# Altium project MB1389.PrjPcb (part 2 of 3)

## Sheet STLink_V3E_PWR.SchDoc: ST-LINK/V3E-SWD Power Module
size A4; Date: Not used; ApprovedBy: Not used; CheckedBy: Not used; Author: Alphonse BRUNO; CompanyName: STMicroelectronics; DrawnBy: Not used; Engineer: Not used; Organization: Not used; Address1: Not used; Address2: Not used; Address3: Not used; Address4: Not used; DocumentNumber: Not used; Revision: Not used; SheetNumber: 8; SheetTotal: 8; CurrentTime: Not used; CurrentDate: Not used; Time: Not used; DocumentFullPathAndName: Not used; DocumentName: Not used; ModifiedDate: Not used; ImagePath: Not used; ProjectName: Not used; Application_BuildNumber: Not used
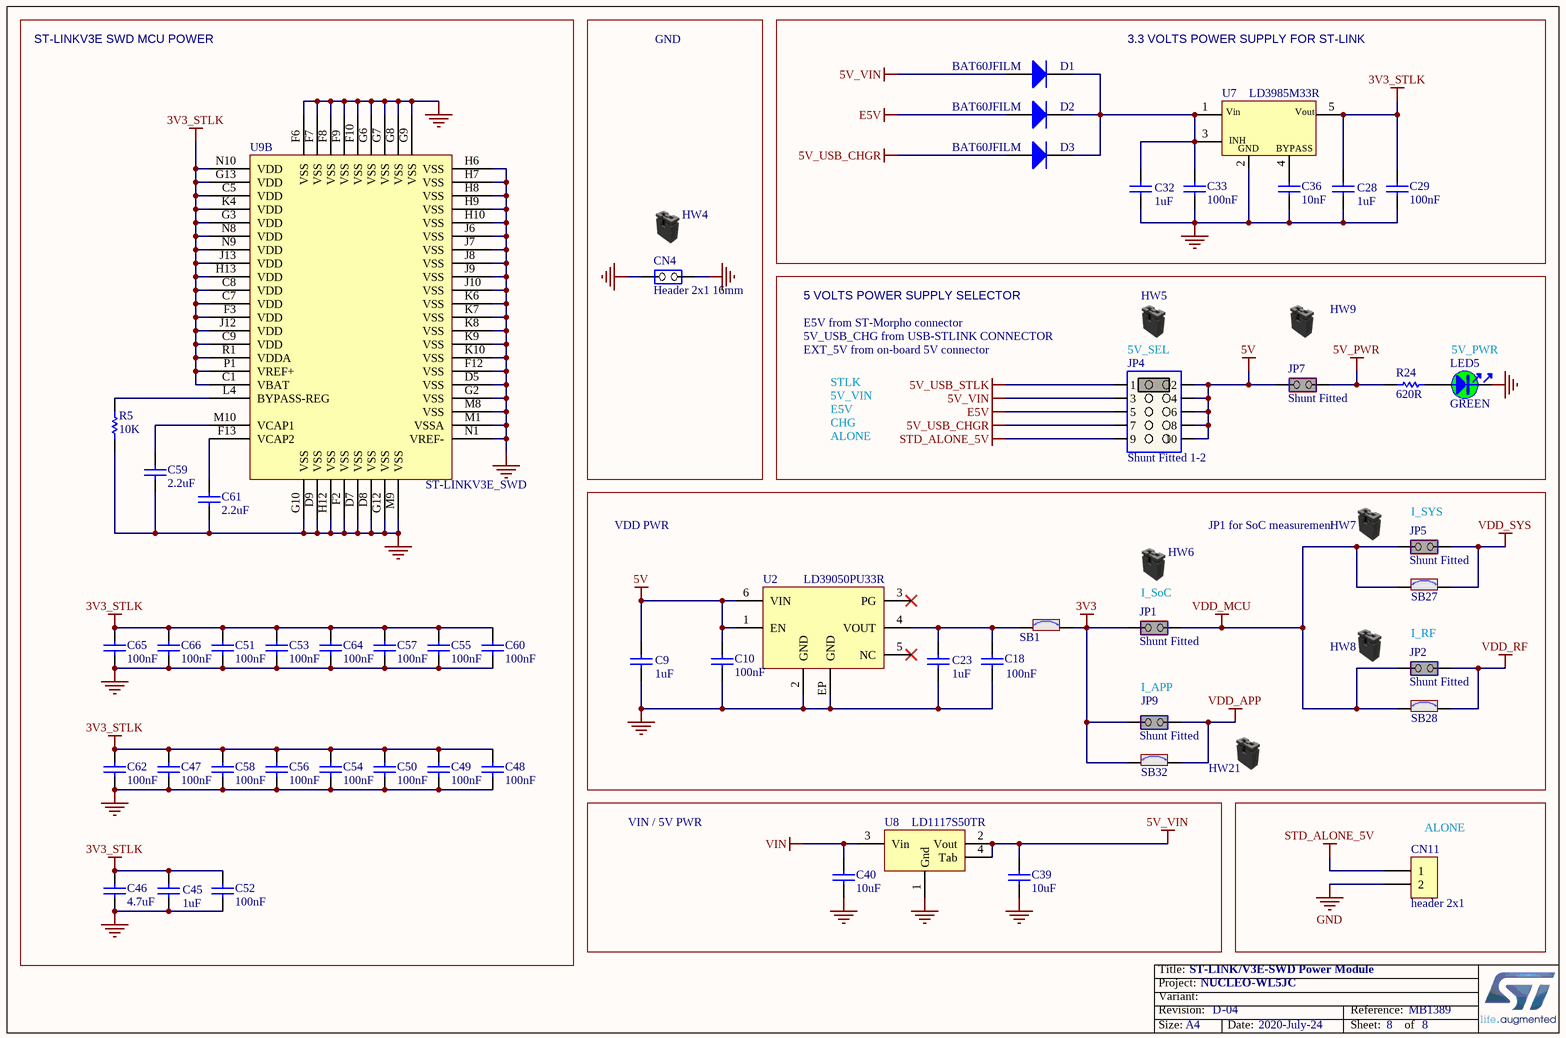
[diagram p4: STLink_V3E_PWR.SchDoc]

### Parts
C9  value 1uF  [C0603]
C10  value 100nF  [C0402]
C18  value 100nF  [C0402]
C23  value 1uF  [C0603]
C28  value 1uF  [C0603]
C29  value 100nF  [C0402]
C32  value 1uF  [C0603]
C33  value 100nF  [C0402]
C36  value 10nF  [C0402]
C39  value 10uF  [C0805]
C40  value 10uF  [C0805]
C45  value 1uF  [C0603]
C46  value 4.7uF  [C0603]
C47  value 100nF  [C0402]
C48  value 100nF  [C0402]
C49  value 100nF  [C0402]
C50  value 100nF  [C0402]
C51  value 100nF  [C0402]
C52  value 100nF  [C0402]
C53  value 100nF  [C0402]
C54  value 100nF  [C0402]
C55  value 100nF  [C0402]
C56  value 100nF  [C0402]
C57  value 100nF  [C0402]
C58  value 100nF  [C0402]
C59  value 2.2uF  [C0603]
C60  value 100nF  [C0402]
C61  value 2.2uF  [C0603]
C62  value 100nF  [C0402]
C64  value 100nF  [C0402]
C65  value 100nF  [C0402]
C66  value 100nF  [C0402]
CN4  value Header 2x1 16mm  [CON_SAMTEC_TSW-102-09-X-S]
CN11  value header 2x1  [CON_988-JIUBABA_PHFS25-11-02-G0B115-T-1]
D1  value BAT60JFILM  [DIO_SOD323]
D2  value BAT60JFILM  [DIO_SOD323]
D3  value BAT60JFILM  [DIO_SOD323]
HW4  (no value)  (mechanical)
HW5  (no value)  (mechanical)
HW6  (no value)  (mechanical)
HW7  (no value)  (mechanical)
HW8  (no value)  (mechanical)
HW9  (no value)  (mechanical)
HW21  (no value)  (mechanical)
JP1  value Shunt Fitted  [CON_SAMTEC_TSW-102-07-G-S]
JP2  value Shunt Fitted  [CON_SAMTEC_TSW-102-07-G-S]
JP4  value Shunt Fitted 1-2  [CON_SAMTEC_TSW-105-07-X-D]
JP5  value Shunt Fitted  [CON_SAMTEC_TSW-102-07-G-S]
JP7  value Shunt Fitted  [CON_SAMTEC_TSW-102-07-G-S]
JP9  value Shunt Fitted  [CON_SAMTEC_TSW-102-07-G-S]
LED5  value GREEN  [LED_0603_OSRAM_LG-Q396-PS-35_GREEN_1A2K_H0P4]
R5  value 10K  [R0402]
R24  value 620R  [R0402]
SB1  (no value)  [SOLDER-BRIDGE_R0603-0R]
SB27  (no value)  [SOLDER-BRIDGE_R0603-0R]
SB28  (no value)  [SOLDER-BRIDGE_R0603-0R]
SB32  (no value)  [SOLDER-BRIDGE_R0603-0R]
U2  value LD39050PU33R  [ICC_DFN6-EPAD_3X3_P095]
U7  value LD3985M33R  [REG_SOT23-5L]
U8  value LD1117S50TR  [REG_SOT223-TAB]
U9  value ST-LINKV3E_SWD  [ICC_UFBGA201_176+25_10X10_P065]  (part B of 2)

### Blocks framed on the sheet
ST-LINKV3E SWD MCU POWER: C45-C62 C64-C66 R5 U9
GND: CN4 HW4
3.3 VOLTS POWER SUPPLY FOR ST-LINK: C28 C29 C32 C33 C36 D1-D3 U7
VIN / 5V PWR: C39 C40 U8
ALONE: CN11

### Nets
3V3: JP1.1(COMMON) JP9.1(COMMON) SB1.2 SB32.1
3V3_STLK: C28.2 C29.2 C45.2 C46.2 C47.2 C48.2 C49.2 C50.2 C51.2 C52.2 C53.2 C54.2 C55.2 C56.2 C57.2 C58.2 C60.2 C62.2 C64.2 C65.2 C66.2 U7.5(Vout) U9.C1(VBAT) U9.C5(VDD) U9.C7(VDD) U9.C8(VDD) U9.C9(VDD) U9.F3(VDD) U9.G3(VDD) U9.G13(VDD) U9.H13(VDD) U9.J12(VDD) U9.J13(VDD) U9.K4(VDD) U9.N8(VDD) U9.N9(VDD) U9.N10(VDD) U9.P1(VREF+) U9.R1(VDDA)
5V: C9.2 C10.2 JP4.2 JP4.4 JP4.6 JP4.8 JP4.10 JP7.1(COMMON) U2.1(EN) U2.6(VIN)
5V_PWR: JP7.2(NO) R24.1
5V_USB_CHGR: D3.1(A) JP4.7
5V_USB_STLK: JP4.1
5V_VIN: C39.2 D1.1(A) JP4.3 U8.2(Vout) U8.4(Tab)
E5V: D2.1(A) JP4.5
GND: C9.1 C10.1 C18.1 C23.1 C28.1 C29.1 C32.1 C33.1 C36.1 C39.1 C40.1 C45.1 C46.1 C47.1 C48.1 C49.1 C50.1 C51.1 C52.1 C53.1 C54.1 C55.1 C56.1 C57.1 C58.1 C59.1 C60.1 C61.1 C62.1 C64.1 C65.1 C66.1 CN4.1(COMMON) CN4.2(NO) CN11.2 LED5.2 R5.1 U2.2(GND) U2.EP(GND) U7.2(GND) U8.1(Gnd) U9.D5(VSS) U9.D7(VSS) U9.D8(VSS) U9.D9(VSS) U9.F2(VSS) U9.F6(VSS) U9.F7(VSS) U9.F8(VSS) U9.F9(VSS) U9.F10(VSS) U9.F12(VSS) U9.G2(VSS) U9.G6(VSS) U9.G7(VSS) U9.G8(VSS) U9.G9(VSS) U9.G10(VSS) U9.G12(VSS) U9.H6(VSS) U9.H7(VSS) U9.H8(VSS) U9.H9(VSS) U9.H10(VSS) U9.H12(VSS) U9.J6(VSS) U9.J7(VSS) U9.J8(VSS) U9.J9(VSS) U9.J10(VSS) U9.K6(VSS) U9.K7(VSS) U9.K8(VSS) U9.K9(VSS) U9.K10(VSS) U9.M1(VSSA) U9.M8(VSS) U9.M9(VSS) U9.N1(VREF-)
STD_ALONE_5V: CN11.1 JP4.9
VDD_APP: JP9.2(NO) SB32.2
VDD_MCU: JP1.2(NO) JP2.1(COMMON) JP5.1(COMMON) SB27.1 SB28.1
VDD_RF: JP2.2(NO) SB28.2
VDD_SYS: JP5.2(NO) SB27.2
VIN: C40.2 U8.3(Vin)
NetC18_2: C18.2 C23.2 SB1.1 U2.4(VOUT)
NetC32_2: C32.2 C33.2 D1.2(K) D2.2(K) D3.2(K) U7.1(Vin) U7.3(CE)
NetC36_2: C36.2 U7.4(BYPASS)
NetC59_2: C59.2 U9.M10(VCAP1)
NetC61_2: C61.2 U9.F13(VCAP2)
NetLED5_1: LED5.1 R24.2
NetR5_2: R5.2 U9.L4(BYPASS-REG)

Not connected (* = marked no-connect by the designer): U2 3(PG)* 5(NC)*

### Notes on the sheet
- 5 VOLTS POWER SUPPLY SELECTOR
- E5V from ST-Morpho connector
- 5V_USB_CHG from USB-STLINK CONNECTOR
- EXT_5V from on-board 5V connector
- STLK
- 5V_SEL
- 5V_PWR
- E5V
- 5V_VIN
- CHG
- ALONE
- (near JP5) I_SYS
- VDD PWR
- (near HW6) JP1 for SoC measurement
- I_SoC
- I_RF
- (near JP9) I_APP
- Title:
- Project:
- Size:
- Revision:
- Variant:
- A4
- -
- Date:
- Reference:
- Sheet:
- of
- (in symbol MCD-00086) INH

### Library data of the parts
C9 C23 C28 C32 C45 = MCD-00010: Capacitor, MLCC, 1uF, 16V, X5R, 10%, 0603, T=0,8mm; Manufacturer_Part_Number: CC0603KRX5R7BB105; Manufacturer: YAGEO; Provided_By: SUBCO; ECCN_US: EAR99; ECCN_EU: NEC; Internal_Part_Number: MCD-00010; Status: Released; Package: C0603; ComponentLink1Description: Datasheet; Part_Type: Capacitor; ComponentLink1URL: http://tunmcdsvn.tun.st.com/Component_Datasheet_Library/Trunk/Capacitors/Yageo_Multilayer_capacitor_X5R_series_100pF_to_100uF
C10 C18 C29 C33 C47-C58 C60 C62 C64-C66 = MCD-00102: Capacitor, MLCC, 100nF, 16V, X7R, 10%, 0402, T=0,5mm; Manufacturer_Part_Number: CC0402KRX7R7BB104; Manufacturer: YAGEO; Alternate_Manufacturer_Part_Number: GCM155R71C104KA55D; Alternate_Manufacturer: MURATA; Provided_By: SUBCO; ECCN_US: EAR99; ECCN_EU: NEC; Internal_Part_Number: MCD-00102; Status: Released; Package: C0402; ComponentLink1Description: Datasheet; Part_Type: Capacitor; ComponentLink1URL: http://tunmcdsvn.tun.st.com/Component_Datasheet_Library/Trunk/Capacitors/Yageo_Multilayer_Capacitor_X7R_series_100pF_to_22uF
C36 = MCD-00011: Capacitor, MLCC, 10nF, 16V, X7R, 10%, 0402, T=0.5mm; Manufacturer_Part_Number: CC0402KRX7R7BB103; Manufacturer: YAGEO; Provided_By: SUBCO; ECCN_US: EAR99; ECCN_EU: NEC; Internal_Part_Number: MCD-00011; Status: Released; Part_Type: Capacitor; Package: C0402; ComponentLink1Description: Datasheet; ComponentLink1URL: http://tunmcdsvn.tun.st.com/Component_Datasheet_Library/Trunk/Capacitors/Yageo_Multilayer_Capacitor_X7R_series_100pF_to_22uF
C39 C40 = MCD-00014: Capacitor, MLCC, 10uF, 25V, X5R, 10%, 0805, T=0,85mm; Manufacturer_Part_Number: CC0805KRX5R8BB106; Manufacturer: YAGEO; Provided_By: SUBCO; ECCN_US: EAR99; ECCN_EU: NEC; Internal_Part_Number: MCD-00014; ComponentLink1Description: Datasheet; Status: Released; Part_Type: Capacitor; Package: C0805; ComponentLink1URL: http://tunmcdsvn.tun.st.com/Component_Datasheet_Library/Trunk/Capacitors/Yageo_Multilayer_capacitor_X5R_series_100pF_to_100uF
C46 = MCD-00009: Capacitor, MLCC, 4.7uF, 16V, X5R, 10%, 0603, T=0.8mm; Manufacturer_Part_Number: CC0603KRX5R7BB475; Manufacturer: YAGEO; Provided_By: SUBCO; ECCN_US: EAR99; ECCN_EU: NEC; Internal_Part_Number: MCD-00009; Status: Released; Part_Type: Capacitor; Package: C0603; ComponentLink1Description: Datasheet; ComponentLink1URL: http://tunmcdsvn.tun.st.com/Component_Datasheet_Library/Trunk/Capacitors/Yageo_Multilayer_capacitor_X5R_series_100pF_to_100uF
C59 C61 = MCD-00012: Capacitor, MLCC, 2.2uF, 10V, X5R, 10%, 0603, T=0,8mm; Manufacturer_Part_Number: CC0603KRX5R6BB225; Manufacturer: YAGEO; Alternate_Manufacturer_Part_Number: C0603C225K8PACTU; Alternate_Manufacturer: KEMET; BMS_Part_Number: 9142010; Provided_By: SUBCO; ECCN_US: EAR99; ECCN_EU: NEC; Internal_Part_Number: MCD-00012; Status: Released; Part_Type: Capacitor; Package: C0603; ComponentLink1Description: Datasheet; ComponentLink1URL: http://tunmcdsvn.tun.st.com/Component_Datasheet_Library/Trunk/Capacitors/Yageo_Multilayer_capacitor_X5R_series_100pF_to_100uF
CN4 = MCD-00214: Header, 2x1, 2,54mm, VR, TH, Height 5.84mm/10.16mm; Part_Type: Connector; Manufacturer_Part_Number: TSW-102-09-x-S; Manufacturer: SAMTEC; Provided_By: SUBCO; Internal_Part_Number: MCD-00214; Status: Released; ComponentLink1Description: Datasheet; ComponentLink1URL: http://tunmcdsvn.tun.st.com/Component_Datasheet_Library/Trunk/Connectors/Samtec_TSW-HTSW-series; ECCN_US: n/a; ECCN_EU: n/a
CN11 = MCD-00314: Header, 2x1, 2.54mm, VR, TH, Height 6mm/3mm; Part_Type: Connector; Manufacturer_Part_Number: PHFS25-11-02-G0B115-T-1; Manufacturer: JIUBABA; Provided_By: SUBCO; Internal_Part_Number: MCD-00314; Status: Released; ComponentLink1Description: Datasheet; ComponentLink1URL: http://tunmcdsvn.tun.st.com/Component_Datasheet_Library/Trunk/Connectors/Jiubaba_PHFS25_11XXXXXXXXXX; ECCN_US: n/a; ECCN_EU: n/a
D1-D3 = MCD-00034: BAT60JFILM; Manufacturer: STMICROELECTRONICS; Part_Type: Diode; BMS_Part_Number: 9151097; Provided_By: SUBCO with ST control; ECCN_US: EAR99; ECCN_EU: NEC; Internal_Part_Number: MCD-00034; Status: Released; Manufacturer_Part_Number: BAT60JFILM; ComponentLink1Description: Datasheet; ComponentLink1URL: http://tunmcdsvn.tun.st.com/Component_Datasheet_Library/Trunk/Diodes/STM_Diode_BAT60JFILM-SOD323
HW4-HW9 HW21 = MCD-00043: SHUNT 2.54mm BLACK; Manufacturer_Part_Number: SNT-100-BK-G; Manufacturer: SAMTEC; Part_Type: Mechanical; Alternate_Manufacturer_Part_Number: 316102S111A; Alternate_Manufacturer: JIUBABA; Provided_By: SUBCO; Value: SNT-100-BK-G; Internal_Part_Number: MCD-00043; ComponentLink1Description: Datasheet; Status: Released; ComponentLink1URL: http://tunmcdsvn.tun.st.com/Component_Datasheet_Library/Trunk/Connectors/Samtec_Shunt_Jumper_SNT100; ECCN_US: n/a; ECCN_EU: n/a
JP1 JP2 JP5 JP7 JP9 = MCD-00683: Header, 2x1, 2,54mm, VR, TH, Height 5.84mm/2.54mm - Shunt Fitted by default; Part_Type: Connector; Manufacturer_Part_Number: TSW-102-07-x-S; Manufacturer: SAMTEC; Alternate_Manufacturer_Part_Number: 313102S111116; Alternate_Manufacturer: LIANYI; Provided_By: SUBCO; Internal_Part_Number: MCD-00683; Status: Released; ComponentLink1Description: Datasheet; ComponentLink1URL: http://tunmcdsvn.tun.st.com/Component_Datasheet_Library/Trunk/Connectors/Samtec_TSW-HTSW-series; ECCN_US: n/a; ECCN_EU: n/a
JP4 = MCD-01203: Header, 5x2, 2,54mm, VR, TH, Height 5.84mm/2.54mm - Shunt Fitted 1-2; Part_Type: Connector; Manufacturer_Part_Number: TSW-105-07-x-D; Manufacturer: SAMTEC; BMS_Part_Number: 9083523; Provided_By: SUBCO; Internal_Part_Number: MCD-01203; Status: Released; ComponentLink1Description: Datasheet; ComponentLink1URL: http://tunmcdsvn.tun.st.com/Component_Datasheet_Library/Trunk/Connectors/Samtec_TSW-HTSW-series; ECCN_US: n/a; ECCN_EU: n/a
LED5 = MCD-00588: LED Green, 0603 SMD, Forward Voltage Typ=2V, Max=2.5V; Part_Type: Display; Manufacturer_Part_Number: LG Q396-PS-35; Manufacturer: OSRAM OPTO SEMICONDUCTORS; Alternate_Manufacturer_Part_Number: VLMTG1300-GS08; Alternate_Manufacturer: VISHAY SEMICONDUCTOR OPTO DIVISION; Provided_By: SUBCO; Internal_Part_Number: MCD-00588; Status: Released; Package: LED 0603; ComponentLink1Description: Datasheet; ComponentLink1URL: http://tunmcdsvn.tun.st.com/Component_Datasheet_Library/Trunk/Display/OSRAM_LED_GREEN_LG Q396-PS-35; Order_Code_Digikey: LG Q396-PS-35-ND; ECCN_US: n/a; ECCN_EU: n/a
R5 = MCD-00053: Resistor,10K,0402,1%,1/16W; Manufacturer_Part_Number: RC0402FR-0710KL; Manufacturer: YAGEO; BMS_Part_Number: 9131590; Provided_By: SUBCO; ECCN_US: EAR99; ECCN_EU: NEC; Internal_Part_Number: MCD-00053; Status: Released; ComponentLink1Description: Datasheet; Part_Type: Resistor; Package: R0402; ComponentLink1URL: http://tunmcdsvn.tun.st.com/Component_Datasheet_Library/Trunk/Resistors/Yageo_Resistor_RC0402-series
R24 = MCD-00499: Resistor,620R,0402,1%,1/16W; Manufacturer_Part_Number: RC0402FR-07620RL; Manufacturer: YAGEO; Provided_By: SUBCO; ECCN_US: EAR99; ECCN_EU: NEC; Internal_Part_Number: MCD-00499; Status: Released; Part_Type: Resistor; Package: R0402; ComponentLink1Description: Datasheet; ComponentLink1URL: http://tunmcdsvn.tun.st.com/Component_Datasheet_Library/Trunk/Resistors/Yageo_Resistor_RC0402-series
SB1 SB27 SB28 SB32 = MCD-00071: as SB2 on sheet STM32_microcontroller_IOs; Internal_Part_Number: MCD-00071; Status: Released; Package: SB0603; ComponentLink1Description: Datasheet; ComponentLink1URL: http://tunmcdsvn.tun.st.com/Component_Datasheet_Library/Trunk/Resistors/Yageo_Resistor_RC0603-series; ECCN_US: n/a; ECCN_EU: n/a
U2 = MCD-00215: Low quiescent current and low noise voltage regulators; Manufacturer: STMICROELECTRONICS; Part_Type: IC; BMS_Part_Number: 9176126; Provided_By: SUBCO with ST control; ECCN_US: EAR99; ECCN_EU: NEC; Internal_Part_Number: MCD-00215; Manufacturer_Part_Number: LD39050PU33R; Status: Released; ComponentLink1Description: Datasheet; ComponentLink1URL: http://tunmcdsvn.tun.st.com/Component_Datasheet_Library/Trunk/IC/STM_LDO_LD39050PU; Package: DFN6 3x3mm
U7 = MCD-00086: Ultra low drop-low noise BiCMOS voltage, regulators low ESR capacitors compatible; Manufacturer: STMICROELECTRONICS; Part_Type: IC; BMS_Part_Number: 9176161; Provided_By: SUBCO with ST control; ECCN_US: EAR99; ECCN_EU: NEC; Internal_Part_Number: MCD-00086; Status: Released; Manufacturer_Part_Number: LD3985M33R; ComponentLink1Description: Datasheet; ComponentLink1URL: http://tunmcdsvn.tun.st.com/Component_Datasheet_Library/Trunk/IC/STM_LDO_LD3985
U8 = MCD-00088: IC REG LDO 5V 0.8A SOT223; Manufacturer: STMICROELECTRONICS; BMS_Part_Number: 9176133; Provided_By: SUBCO with ST control; ECCN_US: EAR99; ECCN_EU: NEC; Internal_Part_Number: MCD-00088; Manufacturer_Part_Number: LD1117S50TR; ComponentLink1Description: Datasheet; Status: Released; Part_Type: IC; ComponentLink1URL: http://tunmcdsvn.tun.st.com/Component_Datasheet_Library/Trunk/IC/STM_LDO_LD1117; Package: SOT-223
U9 = MCD-00596: STM32F723IEK  (STM32F7) BGA176; Part_Type: IC; Manufacturer_Part_Number: STM32F723IEK6; Manufacturer: STMICROELECTRONICS; BMS_Part_Number: 9175300; Provided_By: SUBCO with ST control; ECCN_US: 3A991A2; ECCN_EU: NEC; Internal_Part_Number: MCD-00596; Status: Released; ComponentLink1Description: Datasheet; ComponentLink1URL: http://tunmcdsvn.tun.st.com/Component_Datasheet_Library/Trunk/IC/BGA176+25L_10x10x0.6_pitch0.65

## Sheet Arduino_extension_connectors.SchDoc: Arduino & Morpho extension connectors
size A4; Date: Not used; ApprovedBy: Not used; CheckedBy: Not used; Author: Not used; CompanyName: STMicroelectronics; DrawnBy: Not used; Engineer: Not used; Organization: Not used; Address1: Not used; Address2: Not used; Address3: Not used; Address4: Not used; DocumentNumber: 6; Revision: Not used; SheetNumber: 6; SheetTotal: 8; CurrentTime: Not used; CurrentDate: Not used; Time: Not used; DocumentFullPathAndName: Not used; DocumentName: Not used; ModifiedDate: Not used; ImagePath: Not used; ProjectName: Not used; Application_BuildNumber: Not used
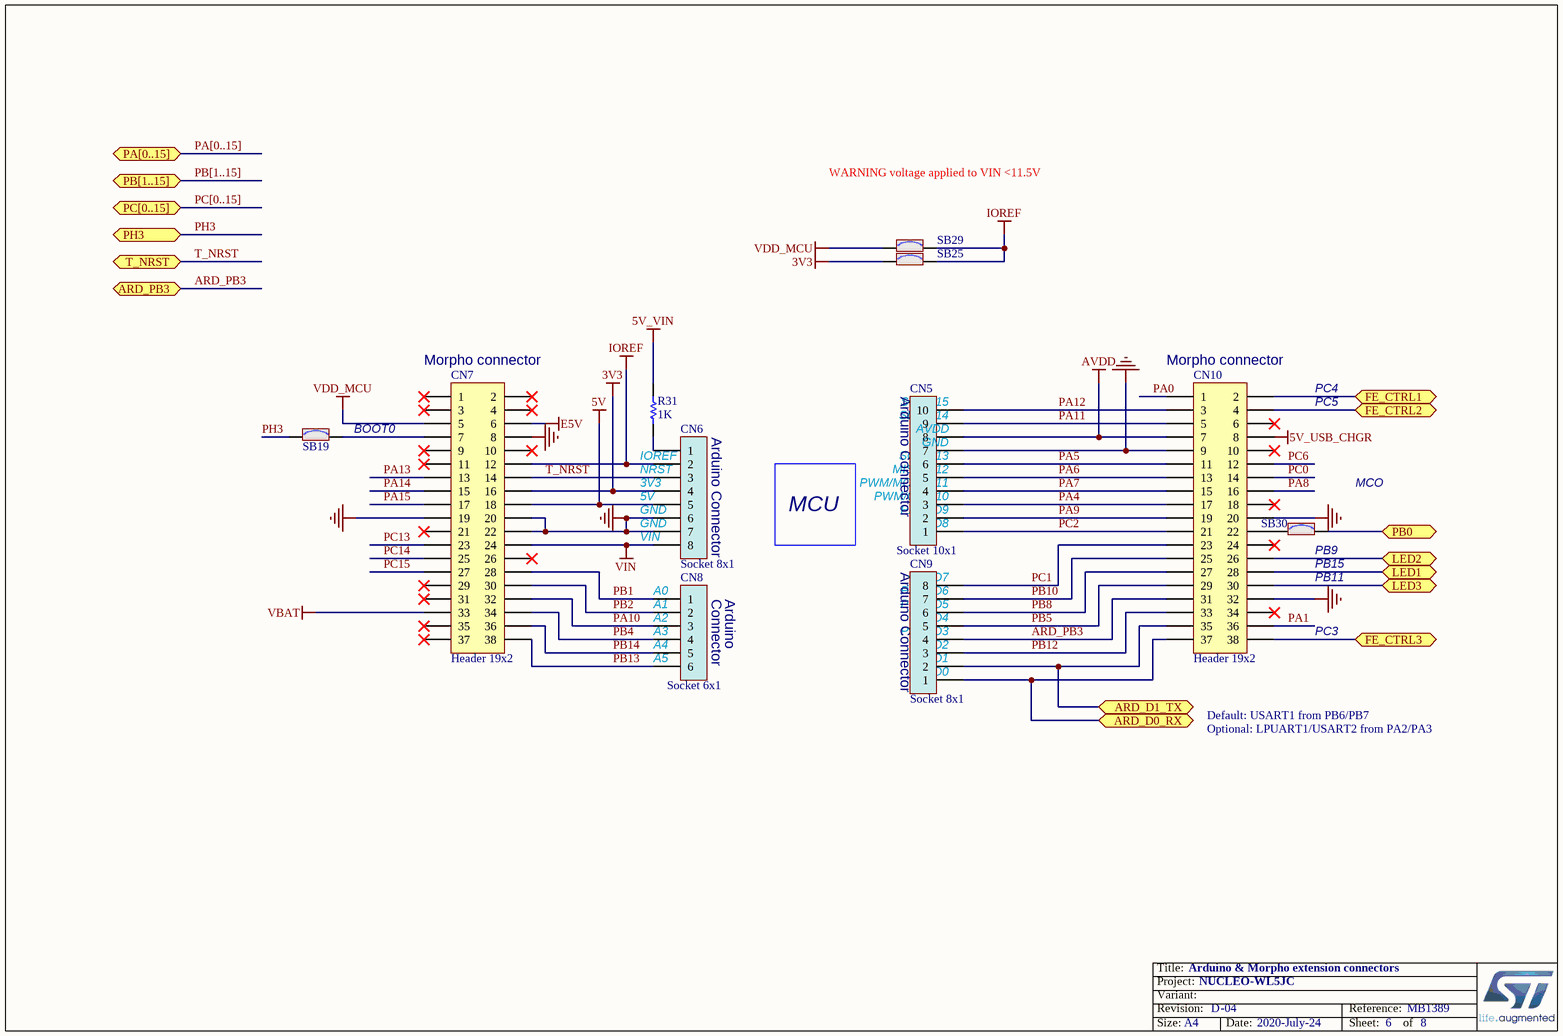
[diagram p5: Arduino_extension_connectors.SchDoc]

### Parts
CN5  value Socket 10x1  [CON_SAMTEC_SSW-110-03-X-S]
CN6  value Socket 8x1  [CON_SAMTEC_SSW-108-03-X-S]
CN7  value Header 19x2  [CON_SAMTEC_TSW-119-09-X-D]
CN8  value Socket 6x1  [CON_SAMTEC_SSW-106-03-X-S]
CN9  value Socket 8x1  [CON_SAMTEC_SSW-108-03-X-S]
CN10  value Header 19x2  [CON_SAMTEC_TSW-119-09-X-D]
R31  value 1K  [R0603]
SB19  (no value)  [SOLDER-BRIDGE_R0603-0R]
SB25  (no value)  [SOLDER-BRIDGE_R0603-0R]
SB29  (no value)  [SOLDER-BRIDGE_R0603-0R]
SB30  (no value)  [SOLDER-BRIDGE_R0603-0R]

### Ports
ARD_D0_RX, ARD_D1_TX, ARD_PB3, FE_CTRL1, FE_CTRL2, FE_CTRL3, LED1, LED2, LED3, PA[0..15] (bidir), PB0, PB[1..15] (bidir), PC[0..15] (bidir), PH3, T_NRST

### Nets
3V3: CN6.4 CN7.16 SB25.1
5V: CN6.5 CN7.18
5V_USB_CHGR: CN10.8
5V_VIN: R31.2
AVDD: CN5.8 CN10.7
E5V: CN7.6
GND: CN5.7 CN6.6 CN6.7 CN7.8 CN7.19 CN7.20 CN7.22 CN10.9 CN10.20 CN10.32
IOREF: CN6.2 CN7.12 SB25.2 SB29.2
VBAT: CN7.33
VDD_MCU: CN7.5 SB29.1
VIN: CN6.8 CN7.24
ARD_D0_RX: CN9.1 CN10.37 ; port ARD_D0_RX
ARD_D1_TX: CN9.2 CN10.35 ; port ARD_D1_TX
ARD_PB3: CN9.4 CN10.31 ; port ARD_PB3
FE_CTRL1: CN10.2 ; port FE_CTRL1
FE_CTRL2: CN10.4 ; port FE_CTRL2
FE_CTRL3: CN10.38 ; port FE_CTRL3
LED1: CN10.28 ; port LED1
LED2: CN10.26 ; port LED2
LED3: CN10.30 ; port LED3
PA0: CN10.1
PA1: CN10.36
PA4: CN5.3 CN10.17
PA5: CN5.6 CN10.11
PA6: CN5.5 CN10.13
PA7: CN5.4 CN10.15
PA8: CN10.16
PA9: CN5.2 CN10.19
PA10: CN7.32 CN8.3
PA11: CN5.9 CN10.5
PA12: CN5.10 CN10.3
PA13: CN7.13
PA14: CN7.15
PA15: CN7.17
PB0: SB30.2 ; port PB0
PB1: CN7.28 CN8.1
PB2: CN7.30 CN8.2
PB4: CN7.34 CN8.4
PB5: CN9.5 CN10.29
PB8: CN9.6 CN10.27
PB10: CN9.7 CN10.25
PB12: CN9.3 CN10.33
PB13: CN7.38 CN8.6
PB14: CN7.36 CN8.5
PC0: CN10.14
PC1: CN9.8 CN10.23
PC2: CN5.1 CN10.21
PC6: CN10.12
PC13: CN7.23
PC14: CN7.25
PC15: CN7.27
PH3: SB19.1 ; port PH3
T_NRST: CN6.3 CN7.14 ; port T_NRST
NetCN6_1: CN6.1 R31.1
NetCN7_7: CN7.7 SB19.2
NetCN10_22: CN10.22 SB30.1

Not connected (* = marked no-connect by the designer): CN7 1* 2* 3* 4* 9* 10* 11* 21* 26* 29* 31* 35* 37*; CN10 6* 10* 18* 24* 34*

### Buses and harness runs
bus PA[0..15] = port PA[0..15]
bus PB[1..15] = port PB[1..15]
bus PC[0..15] = port PC[0..15]

### Notes on the sheet
- WARNING voltage applied to VIN <11.5V
- (near CN7) Morpho connector
- (near CN10) Morpho connector
- (near CN7) BOOT0
- (near CN6) Arduino Connector
- (near CN5) Arduino Connector
- (near CN5) SDA/D14
- (near CN5) SCL/D15
- (near CN5) AVDD
- (near CN5) GND
- (near CN10) PC4
- (near CN10) PC5
- (near CN6) GND
- (near CN6) 5V
- (near CN6) 3V3
- (near CN6) NRST
- (near CN6) IOREF
- MCU
- (near CN5) PMW/D9
- (near CN5) PWM/CS/D10
- (near CN5) SCK/D13
- (near CN5) MISO/D12
- (near CN5) PWM/MOSI/D11
- (near SB30) MCO
- (near CN6) VIN
- (near CN9) Arduino Connector
- (near CN9) D7
- (near CN5) D8
- (near SB30) PB9
- PB15
- PB11
- (near CN8) A0
- (near CN8) A1
- (near CN8) A2
- (near CN8) A3
- (near CN8) A4
- (near CN8) Connector
- (near CN8) Arduino
- (near CN9) D2
- (near CN9) D4
- (near CN9) PWM/D3
- (near CN9) PWM/D5
- (near CN9) PWM/D6
- (near CN10) PC3
- (near CN8) A5
- (near CN9) RX/D0
- (near CN9) TX/D1
- Default: USART1 from PB6/PB7
  Optional: LPUART1/USART2 from PA2/PA3
- Title:
- Project:
- Size:
- Revision:
- Variant:
- -
- Date:
- Reference:
- Sheet:
- of

### Library data of the parts
CN5 = MCD-00262: Socket, 10x1, 2.54mm, VR, TH, Height 8.51mm/10mm; Manufacturer_Part_Number: SSW-110-03-x-S; Manufacturer: SAMTEC; Part_Type: Connector; Provided_By: SUBCO; Internal_Part_Number: MCD-00262; ComponentLink1Description: Datasheet; Status: Released; ComponentLink1URL: http://tunmcdsvn.tun.st.com/Component_Datasheet_Library/Trunk/Connectors/Samtec_SSW-SSQ-series; ECCN_US: n/a; ECCN_EU: n/a
CN6 CN9 = MCD-00261: Socket, 8x1, 2.54mm, VR, TH, Height 8.51mm/10mm; Manufacturer_Part_Number: SSW-108-03-x-S; Manufacturer: SAMTEC; Part_Type: Connector; Provided_By: SUBCO; Internal_Part_Number: MCD-00261; ComponentLink1Description: Datasheet; Status: Released; ComponentLink1URL: http://tunmcdsvn.tun.st.com/Component_Datasheet_Library/Trunk/Connectors/Samtec_SSW-SSQ-series; ECCN_US: n/a; ECCN_EU: n/a
CN7 CN10 = MCD-00213: Header, 19x2, 2,54mm, VR, TH, Height 5.84mm/10.16mm; Manufacturer_Part_Number: TSW-119-09-x-D; Manufacturer: SAMTEC; Part_Type: Connector; Provided_By: SUBCO; Internal_Part_Number: MCD-00213; ComponentLink1Description: Datasheet; Status: Released; ComponentLink1URL: http://tunmcdsvn.tun.st.com/Component_Datasheet_Library/Trunk/Connectors/Samtec_TSW-HTSW-series; ECCN_US: n/a; ECCN_EU: n/a
CN8 = MCD-00260: Socket, 6x1, 2.54mm, VR, TH, Height 8.51mm/10mm; Manufacturer_Part_Number: SSW-106-03-x-S; Manufacturer: SAMTEC; Part_Type: Connector; Provided_By: SUBCO; Internal_Part_Number: MCD-00260; ComponentLink1Description: Datasheet; Status: Released; ComponentLink1URL: http://tunmcdsvn.tun.st.com/Component_Datasheet_Library/Trunk/Connectors/Samtec_SSW-SSQ-series; ECCN_US: n/a; ECCN_EU: n/a
R31 = MCD-00070: Resistor,1K,0603,1%,1/10W; Manufacturer_Part_Number: RC0603FR-071KL; Manufacturer: YAGEO; Provided_By: SUBCO; ECCN_US: EAR99; ECCN_EU: NEC; Internal_Part_Number: MCD-00070; ComponentLink1Description: Datasheet; Status: Released; Part_Type: Resistor; Package: R0603; ComponentLink1URL: http://tunmcdsvn.tun.st.com/Component_Datasheet_Library/Trunk/Resistors/Yageo_Resistor_RC0603-series
SB19 SB25 SB29 SB30 = MCD-00071: as SB2 on sheet STM32_microcontroller_IOs; Internal_Part_Number: MCD-00071; Status: Released; Package: SB0603; ComponentLink1Description: Datasheet; ComponentLink1URL: http://tunmcdsvn.tun.st.com/Component_Datasheet_Library/Trunk/Resistors/Yageo_Resistor_RC0603-series; ECCN_US: n/a; ECCN_EU: n/a

## Sheet STM32_microcontroller_RF.SchDoc: STM32 microcontroller RF
size A3; Date: Not used; ApprovedBy: Not used; CheckedBy: Not used; Author: Not used; CompanyName: STMicroelectronics; DrawnBy: Not used; Engineer: Not used; Organization: Not used; Address1: Not used; Address2: Not used; Address3: Not used; Address4: Not used; DocumentNumber: 5; Revision: Not used; SheetNumber: 5; SheetTotal: 8; CurrentTime: Not used; CurrentDate: Not used; Time: Not used; DocumentFullPathAndName: Not used; DocumentName: Not used; ModifiedDate: Not used; ImagePath: Not used; ProjectName: Not used; Application_BuildNumber: Not used
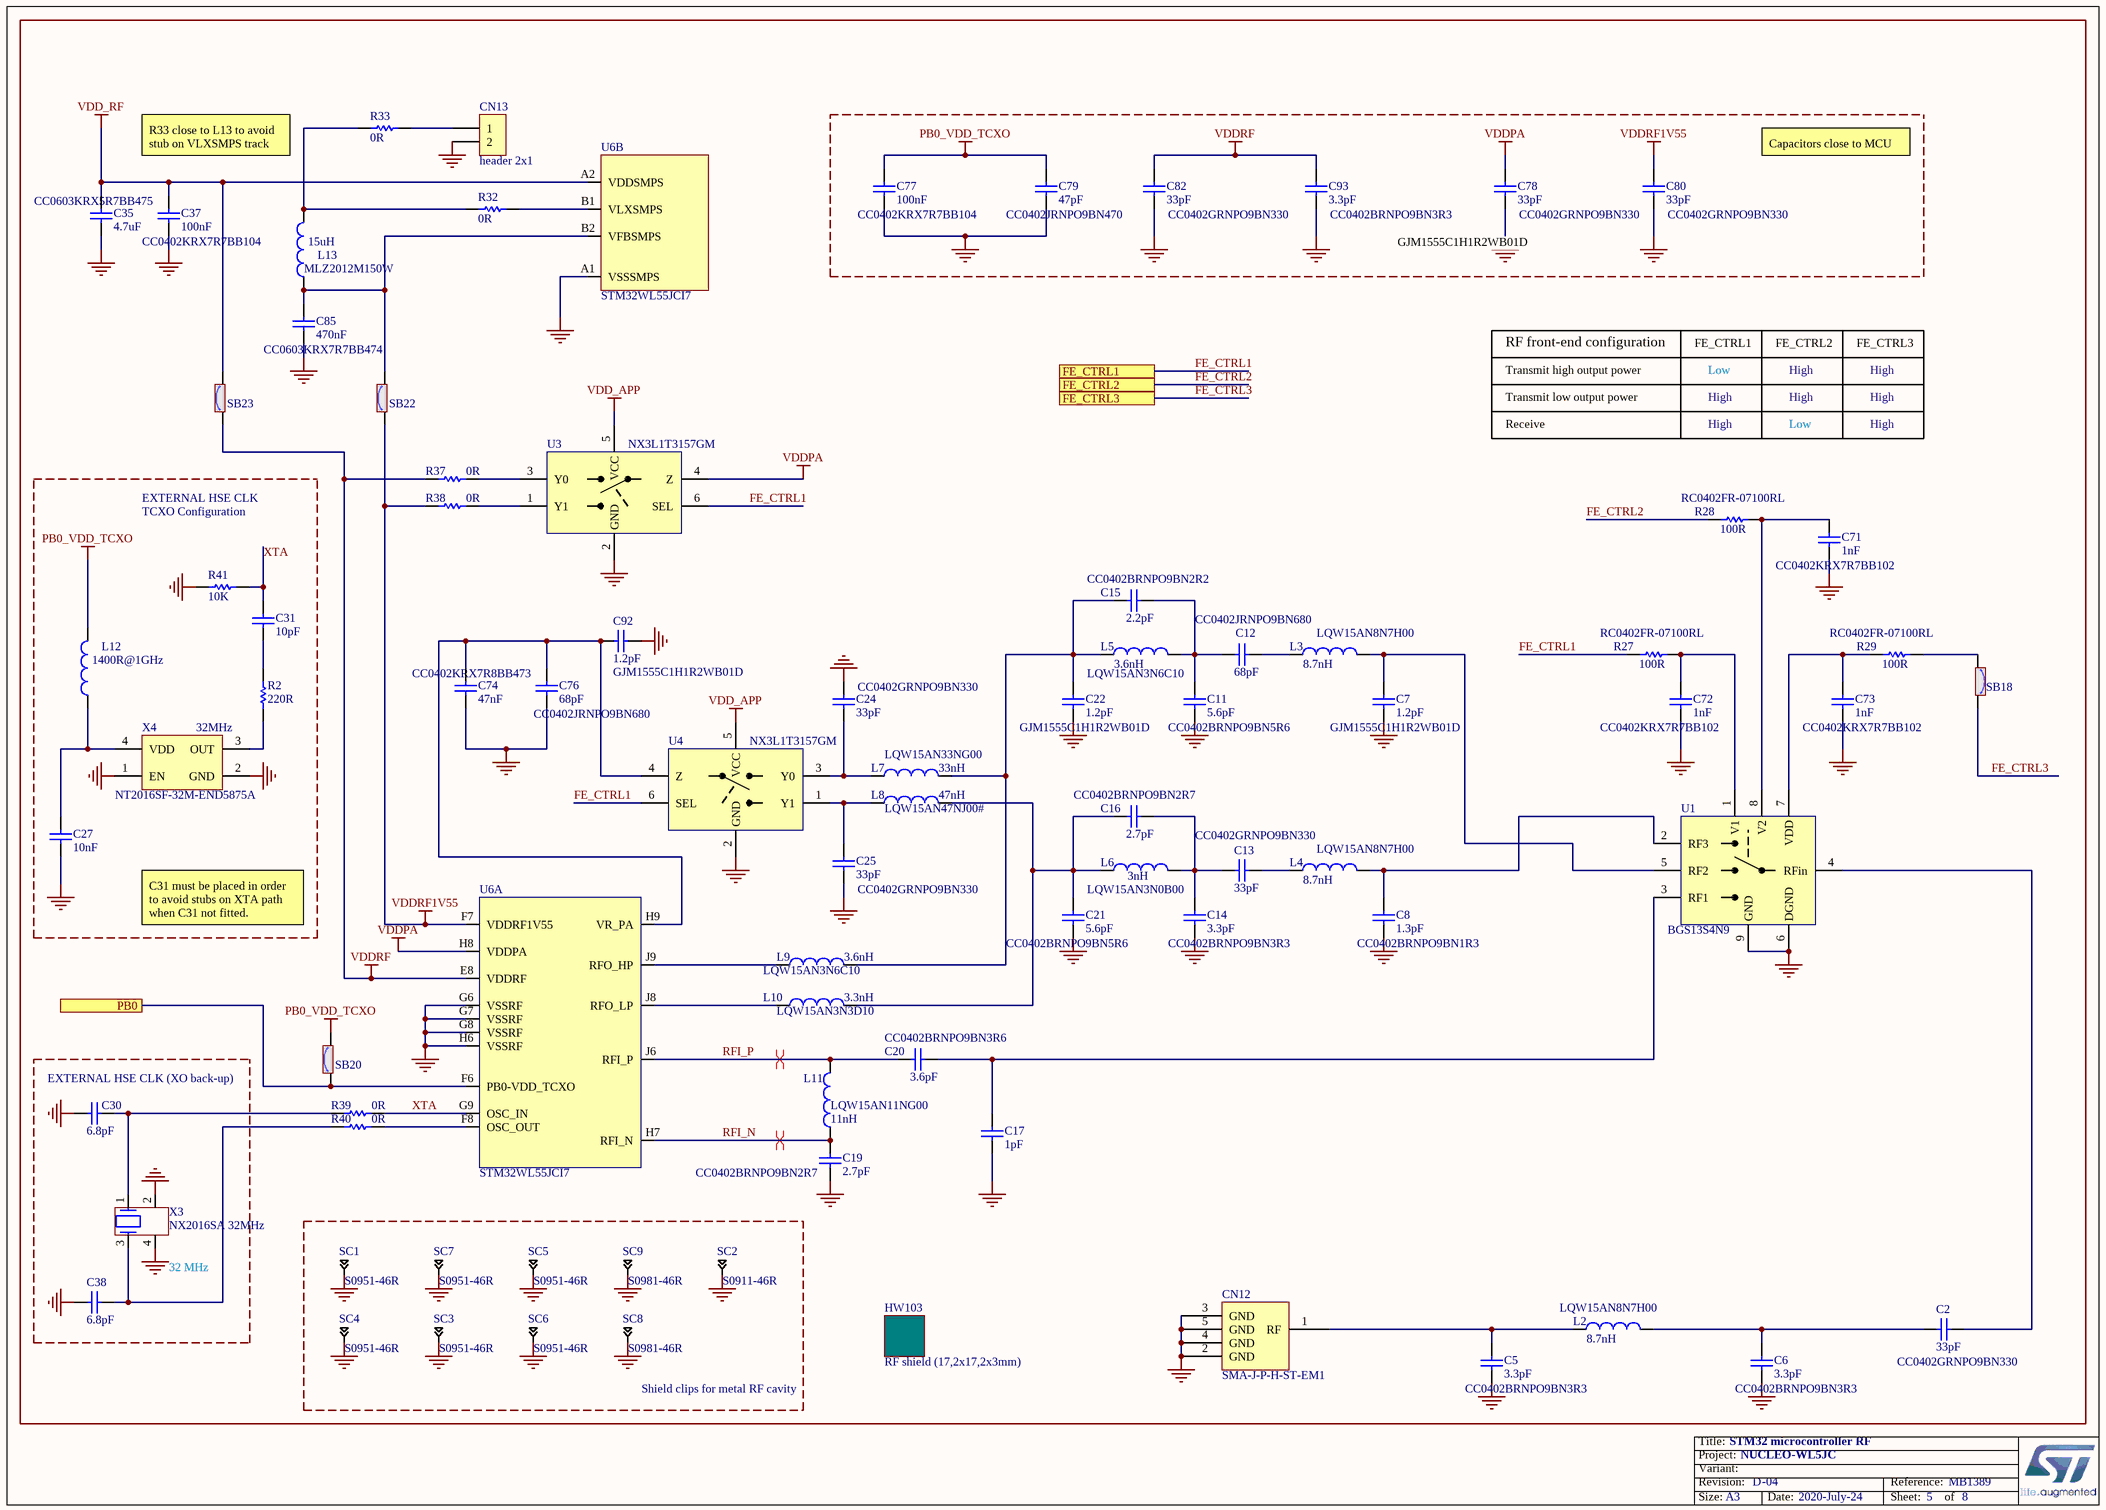
[diagram p6: STM32_microcontroller_RF.SchDoc]

### Parts
C2  value 33pF  Manufacturer_Part_Number: CC0402GRNPO9BN330  [C0402]
C5  value 3.3pF  Manufacturer_Part_Number: CC0402BRNPO9BN3R3  [C0402]
C6  value 3.3pF  Manufacturer_Part_Number: CC0402BRNPO9BN3R3  [C0402]
C7  value 1.2pF  Manufacturer_Part_Number: GJM1555C1H1R2WB01D  [C0402]  (hidden comment: Capacitor)
C8  value 1.3pF  Manufacturer_Part_Number: CC0402BRNPO9BN1R3  [C0402]
C11  value 5.6pF  Manufacturer_Part_Number: CC0402BRNPO9BN5R6  [C0402]  (hidden comment: Capacitor)
C12  value 68pF  Manufacturer_Part_Number: CC0402JRNPO9BN680  [C0402]  (hidden comment: Capacitor)
C13  value 33pF  Manufacturer_Part_Number: CC0402GRNPO9BN330  [C0402]
C14  value 3.3pF  Manufacturer_Part_Number: CC0402BRNPO9BN3R3  [C0402]
C15  value 2.2pF  Manufacturer_Part_Number: CC0402BRNPO9BN2R2  [C0402]  (hidden comment: Capacitor)
C16  value 2.7pF  Manufacturer_Part_Number: CC0402BRNPO9BN2R7  [C0402]
C17  value 1pF  [C0402]  (hidden comment: Capacitor)
C19  value 2.7pF  Manufacturer_Part_Number: CC0402BRNPO9BN2R7  [C0402]
C20  value 3.6pF  Manufacturer_Part_Number: CC0402BRNPO9BN3R6  [C0402]
C21  value 5.6pF  Manufacturer_Part_Number: CC0402BRNPO9BN5R6  [C0402]
C22  value 1.2pF  Manufacturer_Part_Number: GJM1555C1H1R2WB01D  [C0402]  (hidden comment: Capacitor)
C24  value 33pF  Manufacturer_Part_Number: CC0402GRNPO9BN330  [C0402]
C25  value 33pF  Manufacturer_Part_Number: CC0402GRNPO9BN330  [C0402]
C27  value 10nF  [C0402]
C30  value 6.8pF  [C0402]
C31  value 10pF  [C0402]  (hidden comment: Capacitor)
C35  value 4.7uF  Manufacturer_Part_Number: CC0603KRX5R7BB475  [C0603]
C37  value 100nF  Manufacturer_Part_Number: CC0402KRX7R7BB104  [C0402]
C38  value 6.8pF  [C0402]
C71  value 1nF  Manufacturer_Part_Number: CC0402KRX7R7BB102  [C0402]
C72  value 1nF  Manufacturer_Part_Number: CC0402KRX7R7BB102  [C0402]
C73  value 1nF  Manufacturer_Part_Number: CC0402KRX7R7BB102  [C0402]
C74  value 47nF  Manufacturer_Part_Number: CC0402KRX7R8BB473  [C0402]
C76  value 68pF  Manufacturer_Part_Number: CC0402JRNPO9BN680  [C0402]
C77  value 100nF  Manufacturer_Part_Number: CC0402KRX7R7BB104  [C0402]
C78  value 33pF  Manufacturer_Part_Number: CC0402GRNPO9BN330  [C0402]
C79  value 47pF  Manufacturer_Part_Number: CC0402JRNPO9BN470  [C0402]
C80  value 33pF  Manufacturer_Part_Number: CC0402GRNPO9BN330  [C0402]
C82  value 33pF  Manufacturer_Part_Number: CC0402GRNPO9BN330  [C0402]
C85  value 470nF  Manufacturer_Part_Number: CC0603KRX7R7BB474  [C0603]
C92  value 1.2pF  Manufacturer_Part_Number: GJM1555C1H1R2WB01D  [C0402]  (hidden comment: Capacitor)
C93  value 3.3pF  Manufacturer_Part_Number: CC0402BRNPO9BN3R3  [C0402]  (hidden comment: Capacitor)
CN12  value SMA-J-P-H-ST-EM1  [CON_SAMTEC_SMA-J-P-X-ST-EM1]
CN13  value header 2x1  [CON_988-JIUBABA_PHFS25-11-02-G0B115-T-1]
HW103  value RF shield (17,2x17,2x3mm)  [SHIELD_RF_ST-CUSTOM_17P2X17P2_H3]  (hidden comment: Daughter_Board)
L2  value 8.7nH  Manufacturer_Part_Number: LQW15AN8N7H00  [IND_0402_MURATA_LQW15AN_H0P5]
L3  value 8.7nH  Manufacturer_Part_Number: LQW15AN8N7H00  [IND_0402_MURATA_LQW15AN_H0P5]  (hidden comment: Inductor)
L4  value 8.7nH  Manufacturer_Part_Number: LQW15AN8N7H00  [IND_0402_MURATA_LQW15AN_H0P5]
L5  value 3.6nH  Manufacturer_Part_Number: LQW15AN3N6C10  [IND_0402_MURATA_LQW15AN_H0P5]  (hidden comment: Inductor)
L6  value 3nH  Manufacturer_Part_Number: LQW15AN3N0B00  [IND_0402_MURATA_LQW15AN_H0P5]  (hidden comment: Inductor)
L7  value 33nH  Manufacturer_Part_Number: LQW15AN33NG00  [IND_0402_MURATA_LQW15AN_H0P5]  (hidden comment: Inductor)
L8  value 47nH  Manufacturer_Part_Number: LQW15AN47NJ00#  [IND_0402_MURATA_LQW15AN2N4C00X]
L9  value 3.6nH  Manufacturer_Part_Number: LQW15AN3N6C10  [IND_0402_MURATA_LQW15AN_H0P5]
L10  value 3.3nH  Manufacturer_Part_Number: LQW15AN3N3D10  [IND_0402_MURATA_LQW15AN_H0P5]
L11  value 11nH  Manufacturer_Part_Number: LQW15AN11NG00  [IND_0402_MURATA_LQW15AN_H0P5]  (hidden comment: Inductor)
L12  value 1400R@1GHz  [IND_0402_MURATA_BLM15H_H0P5]
L13  value 15uH  Manufacturer_Part_Number: MLZ2012M150W  [IND_TDK_MLZ2012M150W]
R2  value 220R  [R0402]  (hidden comment: Resistor)
R27  value 100R  Manufacturer_Part_Number: RC0402FR-07100RL  [R0402]
R28  value 100R  Manufacturer_Part_Number: RC0402FR-07100RL  [R0402]
R29  value 100R  Manufacturer_Part_Number: RC0402FR-07100RL  [R0402]
R32  value 0R  [R0402]
R33  value 0R  [R0402]
R37  value 0R  [R0402]
R38  value 0R  [R0402]
R39  value 0R  [R0402]
R40  value 0R  [R0402]
R41  value 10K  [R0402]
SB18  (no value)  [SOLDER-BRIDGE_R0603-0R]
SB20  (no value)  [SOLDER-BRIDGE_R0603-0R]
SB22  (no value)  [SOLDER-BRIDGE_R0603-0R]
SB23  (no value)  [SOLDER-BRIDGE_R0603-0R]
SC1  value S0951-46R  [CLIP_HARWIN_S0951-46R]
SC2  value S0911-46R  (hidden comment: Shield-clip_S0951-46R)
SC3  value S0951-46R  [CLIP_HARWIN_S0951-46R]
SC4  value S0951-46R  [CLIP_HARWIN_S0951-46R]
SC5  value S0951-46R  [CLIP_HARWIN_S0951-46R]
SC6  value S0951-46R  [CLIP_HARWIN_S0951-46R]
SC7  value S0951-46R  [CLIP_HARWIN_S0951-46R]
SC8  value S0981-46R  (hidden comment: Shield-clip_S0981-46R)
SC9  value S0981-46R  (hidden comment: Shield-clip_S0981-46R)
U1  value BGS13S4N9  [ICC_TSNP-9-3_1P1X1P1_P040]
U3  value NX3L1T3157GM  [ICC_SOT886_XSON6]
U4  value NX3L1T3157GM  [ICC_SOT886_XSON6]
U6  value STM32WL55JCI7  [ICC_UFBGA73_5X5_P050]  (parts A,B of 5)
X3  value NX2016SA 32MHz  [CRY_NX2016SA_4P]
X4  value 32MHz  [CRY_NDK_NT2016SB_4P]  (hidden comment: NT2016SF)

### Blocks framed on the sheet
Shield clips for metal RF cavity: SC1-SC9

### Ports
FE_CTRL1, FE_CTRL2, FE_CTRL3, PB0

### Nets
GND: C5.1 C6.1 C7.1 C8.1 C11.1 C14.1 C17.1 C19.1 C21.1 C22.1 C24.2 C25.1 C27.1 C30.1 C35.1 C37.2 C38.1 C71.1 C72.1 C73.1 C74.1 C76.1 C77.2 C78.1 C79.1 C80.1 C82.1 C85.1 C92.1 C93.1 CN12.2(GND) CN12.3(GND) CN12.4(GND) CN12.5(GND) CN13.2 R41.1 SC1.1 SC2.1 SC3.1 SC4.1 SC5.1 SC6.1 SC7.1 SC8.1 SC9.1 U1.6(DGND) U1.9(GND) U3.2(GND) U4.2(GND) U6.A1(VSSSMPS) U6.G6(VSSRF) U6.G7(VSSRF) U6.G8(VSSRF) U6.H6(VSSRF) X3.2 X3.4 X4.1(EN) X4.2(GND)
PB0_VDD_TCXO: C77.1 C79.2 L12.2 SB20.2
VDD_APP: U3.5(VCC) U4.5(VCC)
VDD_RF: C35.2 C37.1 SB23.2 U6.A2(VDDSMPS)
VDDPA: C78.2 U3.4(Z) U6.H8(VDDPA)
VDDRF: C82.2 C93.2 R37.2 SB23.1 U6.E8(VDDRF)
VDDRF1V55: C80.2 R38.2 SB22.1 U6.F7(VDDRF1V55)
FE_CTRL1: R27.1 U3.6(SEL) U4.6(SEL) ; port FE_CTRL1
FE_CTRL2: R28.1 ; port FE_CTRL2
FE_CTRL3: SB18.2 ; port FE_CTRL3
PB0: SB20.1 U6.F6(PB0-VDD_TCXO) ; port PB0
RFI_N: C19.2 L11.1 U6.H7(RFI_N)
RFI_P: C20.1 L11.2 U6.J6(RFI_P)
XTA: C31.2 R39.1 R41.2 U6.G9(OSC_IN)
NetC2_1: C2.1 C6.2 L2.2
NetC2_2: C2.2 U1.4(RFin)
NetC5_2: C5.2 CN12.1(RF) L2.1
NetC7_2: C7.2 L3.2 U1.5(RF2)
NetC8_2: C8.2 L4.2 U1.2(RF3)
NetC11_2: C11.2 C12.1 C15.2 L5.2
NetC12_2: C12.2 L3.1
NetC13_1: C13.1 L4.1
NetC13_2: C13.2 C14.2 C16.1 L6.2
NetC15_1: C15.1 C22.2 L5.1 L7.2 L9.2
NetC16_2: C16.2 C21.2 L6.1 L8.2 L10.2
NetC17_2: C17.2 C20.2 U1.3(RF1)
NetC24_1: C24.1 L7.1 U4.3(Y0)
NetC25_2: C25.2 L8.1 U4.1(Y1)
NetC27_2: C27.2 L12.1 X4.4(VDD)
NetC30_2: C30.2 R39.2 X3.1
NetC31_1: C31.1 R2.2
NetC38_2: C38.2 R40.2 X3.3
NetC71_2: C71.2 R28.2 U1.8(V2)
NetC72_2: C72.2 R27.2 U1.1(V1)
NetC73_2: C73.2 R29.1 U1.7(VDD)
NetC74_2: C74.2 C76.2 C92.2 U4.4(Z) U6.H9(VR_PA)
NetC85_2: C85.2 L13.1 SB22.2 U6.B2(VFBSMPS)
NetCN13_1: CN13.1 R33.1
NetL9_1: L9.1 U6.J9(RFO_HP)
NetL10_1: L10.1 U6.J8(RFO_LP)
NetL13_2: L13.2 R32.2 R33.2
NetR2_1: R2.1 X4.3(OUT)
NetR29_2: R29.2 SB18.1
NetR32_1: R32.1 U6.B1(VLXSMPS)
NetR37_1: R37.1 U3.3(Y0)
NetR38_1: R38.1 U3.1(Y1)
NetR40_1: R40.1 U6.F8(OSC_OUT)

### Layout directives
differential pair: RFI_N, RFI_P

### Notes on the sheet
- R33 close to L13 to avoid stub on VLXSMPS track
- Capacitors close to MCU
- (near C78) GJM1555C1H1R2WB01D
- RF front-end configuration
- Transmit high output power
- FE_CTRL1
- Low
- FE_CTRL2
- High
- FE_CTRL3
- Transmit low output power
- Receive
- TCXO Configuration
- EXTERNAL HSE CLK
- C31 must be placed in order to avoid stubs on XTA path when C31 not fitted.
- (near C30) EXTERNAL HSE CLK (XO back-up)
- (near X3) 32 MHz
- Title:
- Project:
- Size:
- Revision:
- Variant:
- A3
- -
- Date:
- Reference:
- Sheet:
- of

### Library data of the parts
C2 C13 C24 C25 C78 C80 C82 = MCD-01784: Capacitor, MLCC, 33pF, 50V, NPO, +/-2%, 0402, T=0,5mm; Manufacturer: YAGEO; Provided_By: SUBCO; Internal_Part_Number: MCD-01784; Status: Checked; Part_Type: Capacitor; Package: C0402; ComponentLink1Description: Datasheet; ComponentLink1URL: http://tunmcdsvn.tun.st.com/Component_Datasheet_Library/Trunk/Capacitors/Yageo_Capacitor_NP0_16V-to-50V; ECCN_US: n/a; ECCN_EU: n/a
C5 C6 C14 = MCD-01775: Capacitor, MLCC, 3.3pF, 50V, NPO, +/-0.1pF, 0402, T=0,5mm; Manufacturer: YAGEO; Provided_By: SUBCO; Internal_Part_Number: MCD-01775; Status: Checked; Part_Type: Capacitor; Package: C0402; ComponentLink1Description: Datasheet; ComponentLink1URL: http://tunmcdsvn.tun.st.com/Component_Datasheet_Library/Trunk/Capacitors/Yageo_Capacitor_NP0_16V-to-50V; ECCN_US: n/a; ECCN_EU: n/a
C7 C22 C92 = MCD-02065: Capacitor, High Q type for high frequency and high power, SMD, 1.2pF, 50V, 0,05pf, 0402; Part_Preference: Recommended; Manufacturer: MURATA; Order_Code_RS: 846-7246; Internal_Part_Number: MCD-02065; BMS_Part_Number: N/A; Status: Checked; Part_Type: Capacitor; Alternate_Manufacturer: N/A; Alternate_Manufacturer_Part_Number: N/A; Package: C0402; ComponentLink1Description: Datasheet; ComponentLink1URL: http://tunmcdsvn.tun.st.com/Component_Datasheet_Library/Trunk/Capacitors/MURATA_Chip_Monolithic_Ceramic_Capacitors; Order_Code_Digikey: 490-11195-2-ND; Order_Code_Farnell: 2781428
C8 = MCD-01772: Capacitor, MLCC, 1.3pF, 50V, NPO, +/-0.1pF, 0402, T=0,5mm; Manufacturer: YAGEO; Provided_By: SUBCO; Internal_Part_Number: MCD-01772; Status: Checked; Part_Type: Capacitor; Package: C0402; ComponentLink1Description: Datasheet; ComponentLink1URL: http://tunmcdsvn.tun.st.com/Component_Datasheet_Library/Trunk/Capacitors/Yageo_Capacitor_NP0_16V-to-50V; ECCN_US: n/a; ECCN_EU: n/a
C11 = MCD-01374: Capacitor, MLCC, 5.6pF, 50V, NPO, +/- 0.1pF, 0402, T=0,5mm; Part_Preference: Recommended; Manufacturer: YAGEO; Internal_Part_Number: MCD-01374; Status: Released; Part_Type: Capacitor; Package: C0402; ComponentLink1Description: Datasheet; ComponentLink1URL: http://tunmcdsvn.tun.st.com/Component_Datasheet_Library/Trunk/Capacitors/Yageo_Capacitor_NP0_16V-to-50V; Order_Code_Digikey: 311-1625-1-ND; Order_Code_Farnell: N/A; Order_Code_RS: N/A
C12 = MCD-01604: Capacitor, MLCC, 68pF, 50V, NPO, +/-5%, 0402, T=0,5mm; Part_Preference: Recommended; Manufacturer: YAGEO; Internal_Part_Number: MCD-01604; Status: Released; Part_Type: Capacitor; Package: C0402; ComponentLink1Description: Datasheet; ComponentLink1URL: http://tunmcdsvn.tun.st.com/Component_Datasheet_Library/Trunk/Capacitors/Yageo_Capacitor_NP0_16V-to-50V; Order_Code_Digikey: 311-1340-1-ND; Order_Code_Farnell: 3019214; Order_Code_RS: N/A
C15 = MCD-01773: Capacitor, MLCC, 2.2pF, 50V, NPO, +/-0.1pF, 0402, T=0,5mm; Part_Preference: Recommended; Manufacturer: YAGEO; Internal_Part_Number: MCD-01773; Status: Released; Part_Type: Capacitor; Package: C0402; ComponentLink1Description: Datasheet; ComponentLink1URL: http://tunmcdsvn.tun.st.com/Component_Datasheet_Library/Trunk/Capacitors/Yageo_Capacitor_NP0_16V-to-50V; Order_Code_Digikey: 311-1618-1-ND; Order_Code_Farnell: N/A; Order_Code_RS: N/A
C16 C19 = MCD-01774: Capacitor, MLCC, 2.7pF, 50V, NPO, +/-0.1pF, 0402, T=0,5mm; Manufacturer: YAGEO; Provided_By: SUBCO; Internal_Part_Number: MCD-01774; Status: Checked; Part_Type: Capacitor; Package: C0402; ComponentLink1Description: Datasheet; ComponentLink1URL: http://tunmcdsvn.tun.st.com/Component_Datasheet_Library/Trunk/Capacitors/Yageo_Capacitor_NP0_16V-to-50V; ECCN_US: n/a; ECCN_EU: n/a
C17 = MCD-01600: Capacitor, MLCC, 1pF, 50V, NPO, +/-0.1pF, 0402, T=0,5mm; Part_Preference: Recommended; Manufacturer: YAGEO; Manufacturer_Part_Number: CC0402BRNPO9BN1R0; Internal_Part_Number: MCD-01600; Status: Released; Part_Type: Capacitor; Package: C0402; ComponentLink1Description: Datasheet; ComponentLink1URL: http://tunmcdsvn.tun.st.com/Component_Datasheet_Library/Trunk/Capacitors/Yageo_Capacitor_NP0_16V-to-50V; Order_Code_Digikey: 311-3613-1-ND; Order_Code_Farnell: N/A; Order_Code_RS: N/A
C20 = MCD-01776: Capacitor, MLCC, 3.6pF, 50V, NPO, +/-0.1pF, 0402, T=0,5mm; Manufacturer: YAGEO; Provided_By: SUBCO; Internal_Part_Number: MCD-01776; Status: Checked; Part_Type: Capacitor; Package: C0402; ComponentLink1Description: Datasheet; ComponentLink1URL: http://tunmcdsvn.tun.st.com/Component_Datasheet_Library/Trunk/Capacitors/Yageo_Capacitor_NP0_16V-to-50V; ECCN_US: n/a; ECCN_EU: n/a
C21 = MCD-01374: Capacitor, MLCC, 5.6pF, 50V, NPO, +/- 0.1pF, 0402, T=0,5mm; Manufacturer: YAGEO; Provided_By: SUBCO; Internal_Part_Number: MCD-01374; Status: Released; Part_Type: Capacitor; Package: C0402; ComponentLink1Description: Datasheet; ComponentLink1URL: http://tunmcdsvn.tun.st.com/Component_Datasheet_Library/Trunk/Capacitors/Yageo_Capacitor_NP0_16V-to-50V; ECCN_US: N/A; ECCN_EU: N/A
C27 = MCD-00011: Capacitor, MLCC, 10nF, 16V, X7R, 10%, 0402, T=0.5mm; Manufacturer_Part_Number: CC0402KRX7R7BB103; Manufacturer: YAGEO; Provided_By: SUBCO; ECCN_US: EAR99; ECCN_EU: NEC; Internal_Part_Number: MCD-00011; Status: Released; Part_Type: Capacitor; Package: C0402; ComponentLink1Description: Datasheet; ComponentLink1URL: http://tunmcdsvn.tun.st.com/Component_Datasheet_Library/Trunk/Capacitors/Yageo_Multilayer_Capacitor_X7R_series_100pF_to_22uF
C30 C38 = MCD-00674: Capacitor, MLCC, 6.8pF, 50V, NPO, +-0.25pF, 0402, T=0.5mm; Manufacturer_Part_Number: CC0402CRNPO9BN6R8; Manufacturer: YAGEO; Provided_By: SUBCO; Internal_Part_Number: MCD-00674; Status: Released; Part_Type: Capacitor; Package: C0402; ComponentLink1Description: Datasheet; ComponentLink1URL: http://tunmcdsvn.tun.st.com/Component_Datasheet_Library/Trunk/Capacitors/Yageo_Capacitor_NP0_16V-to-50V; ECCN_US: N/A; ECCN_EU: N/A
C31 = MCD-00015: Capacitor, MLCC, 10pF, 50V, NPO, +/-5%, 0402, T=0,5mm; Part_Preference: Recommended; Manufacturer: YAGEO; Manufacturer_Part_Number: CC0402JRNPO9BN100; Internal_Part_Number: MCD-00015; Status: Released; Part_Type: Capacitor; Package: C0402; ComponentLink1Description: Datasheet; ComponentLink1URL: http://tunmcdsvn.tun.st.com/Component_Datasheet_Library/Trunk/Capacitors/Yageo_Capacitor_NP0_16V-to-50V
C35 = MCD-00009: Capacitor, MLCC, 4.7uF, 16V, X5R, 10%, 0603, T=0.8mm; Manufacturer: YAGEO; Provided_By: SUBCO; ECCN_US: EAR99; ECCN_EU: NEC; Internal_Part_Number: MCD-00009; ComponentLink1Description: Datasheet; Status: Released; Part_Type: Capacitor; Package: C0603; ComponentLink1URL: http://tunmcdsvn.tun.st.com/Component_Datasheet_Library/Trunk/Capacitors/Yageo_Multilayer_capacitor_X5R_series_100pF_to_100uF
C37 C77 = MCD-00102: Capacitor, MLCC, 100nF, 16V, X7R, 10%, 0402, T=0,5mm; Manufacturer: YAGEO; Alternate_Manufacturer_Part_Number: GCM155R71C104KA55D; Alternate_Manufacturer: MURATA; Provided_By: SUBCO; ECCN_US: EAR99; ECCN_EU: NEC; Internal_Part_Number: MCD-00102; Status: Released; Package: C0402; ComponentLink1Description: Datasheet; Part_Type: Capacitor; ComponentLink1URL: http://tunmcdsvn.tun.st.com/Component_Datasheet_Library/Trunk/Capacitors/Yageo_Multilayer_Capacitor_X7R_series_100pF_to_22uF
C71-C73 = MCD-00198: Capacitor, MLCC, 1nF, 16V, X7R, 10%, 0402, T=0.5mm; Manufacturer: YAGEO; Provided_By: SUBCO; ECCN_US: EAR99; ECCN_EU: NEC; Internal_Part_Number: MCD-00198; Status: Released; Part_Type: Capacitor; Package: C0402; ComponentLink1Description: Datasheet; ComponentLink1URL: http://tunmcdsvn.tun.st.com/Component_Datasheet_Library/Trunk/Capacitors/Yageo_Multilayer_Capacitor_X7R_series_100pF_to_22uF
C74 = MCD-01605: Capacitor, MLCC, 47nF, 25V, X7R, +-10%, 0402, T=0,5mm; Manufacturer: YAGEO; Provided_By: SUBCO; Internal_Part_Number: MCD-01605; Status: Footprint available; Part_Type: Capacitor; Package: C0402; ComponentLink1Description: Datasheet; ComponentLink1URL: http://tunmcdsvn.tun.st.com/Component_Datasheet_Library/Trunk/Capacitors/Yageo_Multilayer_Capacitor_X7R_series_100pF_to_22uF; ECCN_US: N/A; ECCN_EU: N/A
C76 = MCD-01604: Capacitor, MLCC, 68pF, 50V, NPO, +-5%, 0402, T=0,5mm; Manufacturer: YAGEO; Provided_By: SUBCO; Internal_Part_Number: MCD-01604; Status: Released; Part_Type: Capacitor; Package: C0402; ComponentLink1Description: Datasheet; ComponentLink1URL: http://tunmcdsvn.tun.st.com/Component_Datasheet_Library/Trunk/Capacitors/Yageo_Capacitor_NP0_16V-to-50V; ECCN_US: N/A; ECCN_EU: N/A
C79 = MCD-01603: Capacitor, MLCC, 147pF, 50V, NPO, +-5%, 0402, T=0,5mm; Manufacturer: YAGEO; Provided_By: SUBCO; Internal_Part_Number: MCD-01603; Status: Released; Part_Type: Capacitor; Package: C0402; ComponentLink1Description: Datasheet; ComponentLink1URL: http://tunmcdsvn.tun.st.com/Component_Datasheet_Library/Trunk/Capacitors/Yageo_Capacitor_NP0_16V-to-50V; ECCN_US: N/A; ECCN_EU: N/A
C85 = MCD-01006: Capacitor, MLCC, 470nF, 16V, X7R, 10%, 0603, T=0.8mm; Manufacturer: YAGEO; Provided_By: SUBCO; Internal_Part_Number: MCD-01006; Status: Released; Part_Type: Capacitor; Package: C0603; ComponentLink1Description: Datasheet; ComponentLink1URL: http://tunmcdsvn.tun.st.com/Component_Datasheet_Library/Trunk/Capacitors/Yageo_Multilayer_Capacitor_X7R_series_100pF_to_22uF/; ECCN_US: N/A; ECCN_EU: N/A
C93 = MCD-01775: Capacitor, MLCC, 3.3pF, 50V, NPO, +/-0.1pF, 0402, T=0,5mm; Part_Preference: Recommended; Manufacturer: YAGEO; Internal_Part_Number: MCD-01775; Status: Released; Part_Type: Capacitor; Package: C0402; ComponentLink1Description: Datasheet; ComponentLink1URL: http://tunmcdsvn.tun.st.com/Component_Datasheet_Library/Trunk/Capacitors/Yageo_Capacitor_NP0_16V-to-50V; Order_Code_Digikey: 311-1621-1-ND; Order_Code_Farnell: N/A; Order_Code_RS: N/A
CN12 = MCD-00279: RF SMA connector PCB edge; Manufacturer: SAMTEC; Provided_By: SUBCO; ECCN_US: EAR99; ECCN_EU: NEC; Internal_Part_Number: MCD-00279; Status: Released; Part_Type: Connector; Manufacturer_Part_Number: SMA-J-P-H-ST-EM1; ComponentLink1Description: Datasheet; ComponentLink1URL: http://tunmcdsvn.tun.st.com/Component_Datasheet_Library/Trunk/Connectors/Samtec_sma_SMA_series
CN13 = MCD-00314: Header, 2x1, 2.54mm, VR, TH, Height 6mm/3mm; Part_Type: Connector; Manufacturer_Part_Number: PHFS25-11-02-G0B115-T-1; Manufacturer: JIUBABA; Provided_By: SUBCO; Internal_Part_Number: MCD-00314; Status: Released; ComponentLink1Description: Datasheet; ComponentLink1URL: http://tunmcdsvn.tun.st.com/Component_Datasheet_Library/Trunk/Connectors/Jiubaba_PHFS25_11XXXXXXXXXX; ECCN_US: n/a; ECCN_EU: n/a
HW103 = MCD-02088: RF shield (17,2x17,2x3mm), Brass with Sn finishing, Sheet tickness : 0,2mm; BMS_Part_Number: TBD; Part_Preference: Recommended; Part_Type: Misc; Internal_Part_Number: MCD-02088; Status: Checked; Manufacturer: TBD; Manufacturer_Part_Number: RF shield (17,2x17,2x3mm); Alternate_Manufacturer: N/A; Alternate_Manufacturer_Part_Number: N/A; Package: N/A; ComponentLink1Description: Datasheet; ComponentLink1URL: http://tunmcdsvn.tun.st.com/Component_Datasheet_Library/Trunk/Misc/RF shielded box (17,2x17,2x3mm); Order_Code_Digikey: N/A; Order_Code_Farnell: N/A; Order_Code_RS: N/A
L2 L4 = MCD-01768: 0402 inductor, 8.7nH +/-3%, 540mA max, 0.14 ohm DC max, Q min = 25; Manufacturer: MURATA; Provided_By: SUBCO; Internal_Part_Number: MCD-01768; Status: Checked; Part_Type: Inductor; Package: L0402; ComponentLink1Description: Datasheet; ComponentLink1URL: http://tunmcdsvn.tun.st.com/Component_Datasheet_Library/Trunk/Inductors/Murata_inductor_LQW15ANseries; ECCN_US: n/a; ECCN_EU: n/a
L3 = MCD-01768: 0402 inductor, 8.7nH +/-3%, 540mA max, 0.14 ohm DC max, Q min = 25; Part_Preference: Recommended; Manufacturer: MURATA; Internal_Part_Number: MCD-01768; Status: Released; Part_Type: Inductor; Package: L0402; ComponentLink1Description: Datasheet; ComponentLink1URL: http://tunmcdsvn.tun.st.com/Component_Datasheet_Library/Trunk/Inductors/Murata_inductor_LQW15ANseries
L5 = MCD-01762: 0402 inductor, 3.6nH +/-0.2nH, 900mA max, 0.04 ohm DC max, Q min = 30; Part_Preference: Recommended; Manufacturer: MURATA; Internal_Part_Number: MCD-01762; Status: Released; Part_Type: Inductor; Package: L0402; ComponentLink1Description: Datasheet; ComponentLink1URL: http://tunmcdsvn.tun.st.com/Component_Datasheet_Library/Trunk/Inductors/Murata_inductor_LQW15ANseries
L6 = MCD-01922: 0402 inductor, 3nH +-0.1nH, 750mA max, 0.07 ohm DC max, Q min = 20; Manufacturer: MURATA; Provided_By: SUBCO; Internal_Part_Number: MCD-01922; Status: Footprint available; Part_Type: Inductor; Package: L0402; ComponentLink1Description: Datasheet; ComponentLink1URL: http://tunmcdsvn.tun.st.com/Component_Datasheet_Library/Trunk/Inductors/Murata_inductor_LQW15ANseries; ECCN_US: n/a; ECCN_EU: n/a
L7 = MCD-02069: Inductor, 33nH +/-2%, 260mA max , 0.63 ohm DC max, 0402, Q min = 25.; Part_Preference: Recommended; Manufacturer: MURATA; Order_Code_RS: 169-2777; Internal_Part_Number: MCD-02069; BMS_Part_Number: N/A; Status: Released; Part_Type: Inductor; Alternate_Manufacturer: N/A; Alternate_Manufacturer_Part_Number: N/A; Package: L0402; ComponentLink1Description: Datasheet; ComponentLink1URL: http://tunmcdsvn.tun.st.com/Component_Datasheet_Library/Trunk/Inductors/Murata_inductor_LQW15ANseries; Order_Code_Digikey: 490-6804-1-ND; Order_Code_Farnell: 1762626
L8 = MCD-01609: Inductor, 47nH, +-5%, 210mA, 1.08ohm DC max, 0402; Manufacturer: MURATA; Provided_By: SUBCO; Internal_Part_Number: MCD-01609; Status: Footprint available; Part_Type: Inductor; Package: L0402; ComponentLink1Description: Datasheet; ComponentLink1URL: http://tunmcdsvn.tun.st.com/Component_Datasheet_Library/Trunk/Inductors/Murata_inductor_LQW15ANseries/; ECCN_US: n/a; ECCN_EU: n/a
L9 = MCD-01762: 0402 inductor, 3.6nH +/-0.2nH, 900mA max, 0.04 ohm DC max, Q min = 30; Manufacturer: MURATA; Provided_By: SUBCO; Internal_Part_Number: MCD-01762; Status: Checked; Part_Type: Inductor; Package: L0402; ComponentLink1Description: Datasheet; ComponentLink1URL: http://tunmcdsvn.tun.st.com/Component_Datasheet_Library/Trunk/Inductors/Murata_inductor_LQW15ANseries; ECCN_US: n/a; ECCN_EU: n/a
L10 = MCD-01761: 0402 inductor, 3.3nH +-0.5nH, 900mA max, 0.04 ohm DC max, Q min = 30; Manufacturer: MURATA; Provided_By: SUBCO; Internal_Part_Number: MCD-01761; Status: Checked; Part_Type: Inductor; Package: L0402; ComponentLink1Description: Datasheet; ComponentLink1URL: http://tunmcdsvn.tun.st.com/Component_Datasheet_Library/Trunk/Inductors/Murata_inductor_LQW15ANseries; ECCN_US: n/a; ECCN_EU: n/a
L11 = MCD-01921: 0402 inductor, 11nH +-2%, 500mA max, 0.14 ohm DC max, Q min = 30; Manufacturer: MURATA; Provided_By: SUBCO; Internal_Part_Number: MCD-01921; Status: Footprint available; Part_Type: Inductor; Package: L0402; ComponentLink1Description: Datasheet; ComponentLink1URL: http://tunmcdsvn.tun.st.com/Component_Datasheet_Library/Trunk/Inductors/Murata_inductor_LQW15ANseries; ECCN_US: n/a; ECCN_EU: n/a
L12 = MCD-01610: ferrite bead, 1400ohms at 1GHz, 250mA, 1.1ohms DC max; Manufacturer_Part_Number: BLM15HG102SN1#; Manufacturer: MURATA; Provided_By: SUBCO; Internal_Part_Number: MCD-01610; Status: Footprint available; Part_Type: Inductor; Package: L0402; ComponentLink1Description: Datasheet; ComponentLink1URL: http://tunmcdsvn.tun.st.com/Component_Datasheet_Library/Trunk/Inductors/Murata_ferrite-bead_BLM15series; ECCN_US: n/a; ECCN_EU: n/a
L13 = MCD-01433: MLZ2012 Multilayer Shielded Inductor 15uH, +/-5%; Manufacturer: TDK; Provided_By: SUBCO; Internal_Part_Number: MCD-01433; Status: Checked; Part_Type: Inductor; Package: L0805; ComponentLink1Description: Datasheet; ComponentLink1URL: http://tunmcdsvn.tun.st.com/Component_Datasheet_Library/Trunk/Inductors/TDK_Inductor_MLZ2012%20series/; ECCN_US: n/a; ECCN_EU: n/a
R2 = MCD-00427: Resistor,220R,0402,1%,1/16W; Manufacturer_Part_Number: RC0402FR-07220RL; Manufacturer: YAGEO; ECCN_US: EAR99; ECCN_EU: NEC; Provided_By: SUBCO; Internal_Part_Number: MCD-00427; Status: Released; Part_Type: Resistor; Package: R0402; ComponentLink1Description: Datasheet; ComponentLink1URL: http://tunmcdsvn.tun.st.com/Component_Datasheet_Library/Trunk/Resistors/Yageo_Resistor_RC0402-series
R27-R29 = MCD-00119: Resistor,100R,0402,1%,1/16W; Manufacturer: YAGEO; Provided_By: SUBCO; ECCN_US: EAR99; ECCN_EU: NEC; Internal_Part_Number: MCD-00119; Status: Released; Part_Type: Resistor; Package: R0402; ComponentLink1Description: Datasheet; ComponentLink1URL: http://tunmcdsvn.tun.st.com/Component_Datasheet_Library/Trunk/Resistors/Yageo_Resistor_RC0402-series
R32 R33 R37-R40 = MCD-00052: Resistor,0R,0402,5%,1/16W; Manufacturer_Part_Number: RC0402JR-070RL; Manufacturer: YAGEO; Provided_By: SUBCO; ECCN_US: EAR99; ECCN_EU: NEC; Internal_Part_Number: MCD-00052; Status: Released; Part_Type: Resistor; Package: R0402; ComponentLink1Description: Datasheet; ComponentLink1URL: http://tunmcdsvn.tun.st.com/Component_Datasheet_Library/Trunk/Resistors/Yageo_Resistor_RC0402-series
R41 = MCD-00053: Resistor,10K,0402,1%,1/16W; Manufacturer_Part_Number: RC0402FR-0710KL; Manufacturer: YAGEO; BMS_Part_Number: 9131590; ECCN_US: EAR99; ECCN_EU: NEC; Provided_By: SUBCO; Internal_Part_Number: MCD-00053; Status: Released; Part_Type: Resistor; Package: R0402; ComponentLink1Description: Datasheet; ComponentLink1URL: http://tunmcdsvn.tun.st.com/Component_Datasheet_Library/Trunk/Resistors/Yageo_Resistor_RC0402-series
SB18 SB20 SB22 SB23 = MCD-00071: Solder Bridge ON; Part_Type: Mechanical; Manufacturer_Part_Number: RC0603JR-070RL; Manufacturer: YAGEO; Provided_By: SUBCO; Internal_Part_Number: MCD-00071; Status: Released; Package: SB0603; ComponentLink1Description: Datasheet; ComponentLink1URL: http://tunmcdsvn.tun.st.com/Component_Datasheet_Library/Trunk/Resistors/Yageo_Resistor_RC0603-series; ECCN_US: n/a; ECCN_EU: n/a
SC1 SC3-SC7 = MCD-01587: shield clip Harwin S0951-46R to fix RF shielded cavity; Part_Type: Connector; ECCN_US: tbd; Provided_By: SUBCO; Internal_Part_Number: MCD-01587; Status: Footprint available; Manufacturer_Part_Number: S0951-46R; Manufacturer: HARWIN; Package: na; ComponentLink1Description: Datasheet; ComponentLink1URL: http://tunmcdsvn.tun.st.com/Component_Datasheet_Library/Trunk/Connectors/Harwin_Shield-clip_S0951-46R; ECCN_EU: tbd
SC2 = MCD-02165: shield clip Harwin S0911-46R to fix RF shielded cavity - SMT RFI Shield Clip, Compact (T+R); Part_Type: Misc; Provided_By: SUBCO; PCB_Footprint_Ref1: CLIP_HARWIN_S0911-46R; Internal_Part_Number: MCD-02165; Status: Checked; Manufacturer_Part_Number: S0911-46R; Manufacturer: HARWIN; Alternate_Manufacturer_Part_Number: N/A; Alternate_Manufacturer: N/A; ComponentLink1Description: Datasheet; ComponentLink1URL: http://tunmcdsvn.tun.st.com/Component_Datasheet_Library/Trunk/Connectors/Harwin_Shield-clip_S0911-46R; Order_Code_Digikey: 952-4312-1-ND; Order_Code_Farnell: 3104143; Order_Code_RS: N/A
SC8 SC9 = MCD-02164: shield clip Harwin S0981-46R to fix RF shielded cavity - SMT RFI Shield Clip, Corner (T+R); Part_Type: Misc; Order_Code_RS: 161-3702; Provided_By: SUBCO; PCB_Footprint_Ref1: CLIP_HARWIN_S0981-46R; Internal_Part_Number: MCD-02164; Status: Checked; Manufacturer_Part_Number: S0981-46R; Manufacturer: HARWIN; Alternate_Manufacturer_Part_Number: N/A; Alternate_Manufacturer: N/A; ComponentLink1Description: Datasheet; ComponentLink1URL: http://tunmcdsvn.tun.st.com/Component_Datasheet_Library/Trunk/Connectors/Harwin_Shield-clip_S0981-46R; Order_Code_Digikey: 952-2518-1-ND; Order_Code_Farnell: 2361678
U1 = MCD-02018: Wideband RF SP3T Switch; Part_Type: IC; Manufacturer: INFINEON; ECCN_US: EAR99; ECCN_EU: tbd; Provided_By: SUBCO; Internal_Part_Number: MCD-02018; Status: Checked; Manufacturer_Part_Number: BGS13S4N9; Package: TSNP-9-3; ComponentLink1Description: Datasheet; ComponentLink1URL: http://tunmcdsvn.tun.st.com/Component_Datasheet_Library/Trunk/IC/Infineon_SP3T_BGS13S4N9/Infineon-BGS13S4N9-DS-v01_00-EN.pdf
U3 U4 = MCD-01514: DC switch - Ultra-Low 0.5ohm  SPDT analog switch; Part_Type: IC; Manufacturer: NXP; Provided_By: SUBCO; ECCN_US: EAR99; ECCN_EU: NEC; Internal_Part_Number: MCD-01514; Status: Footprint available; Manufacturer_Part_Number: NX3L1T3157GM; Package: SOT886; ComponentLink1Description: Datasheet; ComponentLink1URL: http://tunmcdsvn.tun.st.com/Component_Datasheet_Library/Trunk/IC/NXP_DCswitch_NX3L1T3157/
U6 = MCD-01435: Multiprotocol Wireless 32-bit MCUwith LPWAN Sub-GHz radio solution; Part_Type: IC; Manufacturer: STMICROELECTRONICS; ECCN_US: tbd; Internal_Part_Number: MCD-01435; Status: Footprint available; Manufacturer_Part_Number: STM32WL55JCI7; Package: UFBGA73; ComponentLink1Description: Datasheet; ComponentLink1URL: http://tunmcdsvn.tun.st.com/Component_Datasheet_Library/Trunk/IC/STM_STM32WL5x; Provided_By: n/a; ECCN_EU: tbd
X3 = MCD-01507: Crystal 32MHz, 10pF, +-10 ppm, 50ohm max, SMD; Part_Type: Crystal_Osc; Manufacturer_Part_Number: NX2016SA 32MHz EXS00A-CS06465; Manufacturer: NDK; Provided_By: SUBCO; ECCN_US: EAR99; ECCN_EU: NEC; Internal_Part_Number: MCD-01507; Status: Footprint available; Package: NX2016SA; ComponentLink1Description: Datasheet; ComponentLink1URL: http://tunmcdsvn.tun.st.com/Component_Datasheet_Library/Trunk/Crystal_Osc/NDK_NX2016SA 32MHz EXS00A-CS06465; Order_Code_Digikey: 644-1300
X4 = MCD-02240: NT2016SF-32M-END5875A; Part_Preference: Recommended; Part_Type: Crystal_Osc; Manufacturer: NDK; Internal_Part_Number: MCD-02240; Status: Checked; Manufacturer_Part_Number: NT2016SF-32M-END5875A; Alternate_Manufacturer: N/A; Alternate_Manufacturer_Part_Number: N/A; Package: 2016 size; ComponentLink1Description: Part_Information; ComponentLink1URL: http://tunmcdsvn.tun.st.com/Component_Datasheet_Library/Trunk/Crystal_Osc/NDK_NT2016SF%2032MHz%20END5875A%20(ETS10B-12472)/; Order_Code_Digikey: N/A; Order_Code_Farnell: N/A; Order_Code_RS: N/A